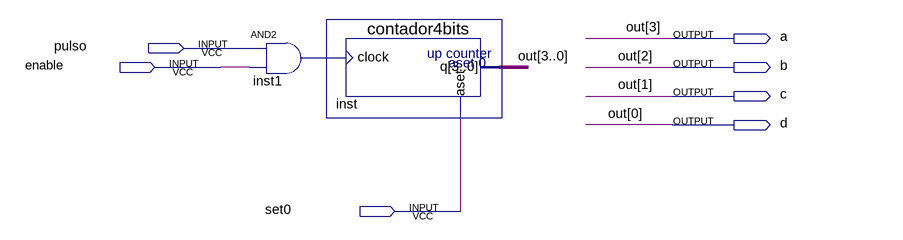
[diagram p0: schematic sheet]
// Quartus schematic contador.bdf as structural Verilog: 2 symbols, 7 pins
module contador (
  input  pulso,
  input  enable,
  input  set0,
  output a,
  output b,
  output c,
  output d
);

  wire inst1_out;

  and inst1 (inst1_out, pulso, enable);
  contador4bits inst (.clock(inst1_out), .aset(set0), .q({a, b, c, d}));

  // Other names for the same wires on the sheet: out[3:0] = {a, b, c, d}
endmodule
